# EasyEDA Pro project 2022-4T-MNT-2.eprj

# Schematic EDA-TEST2
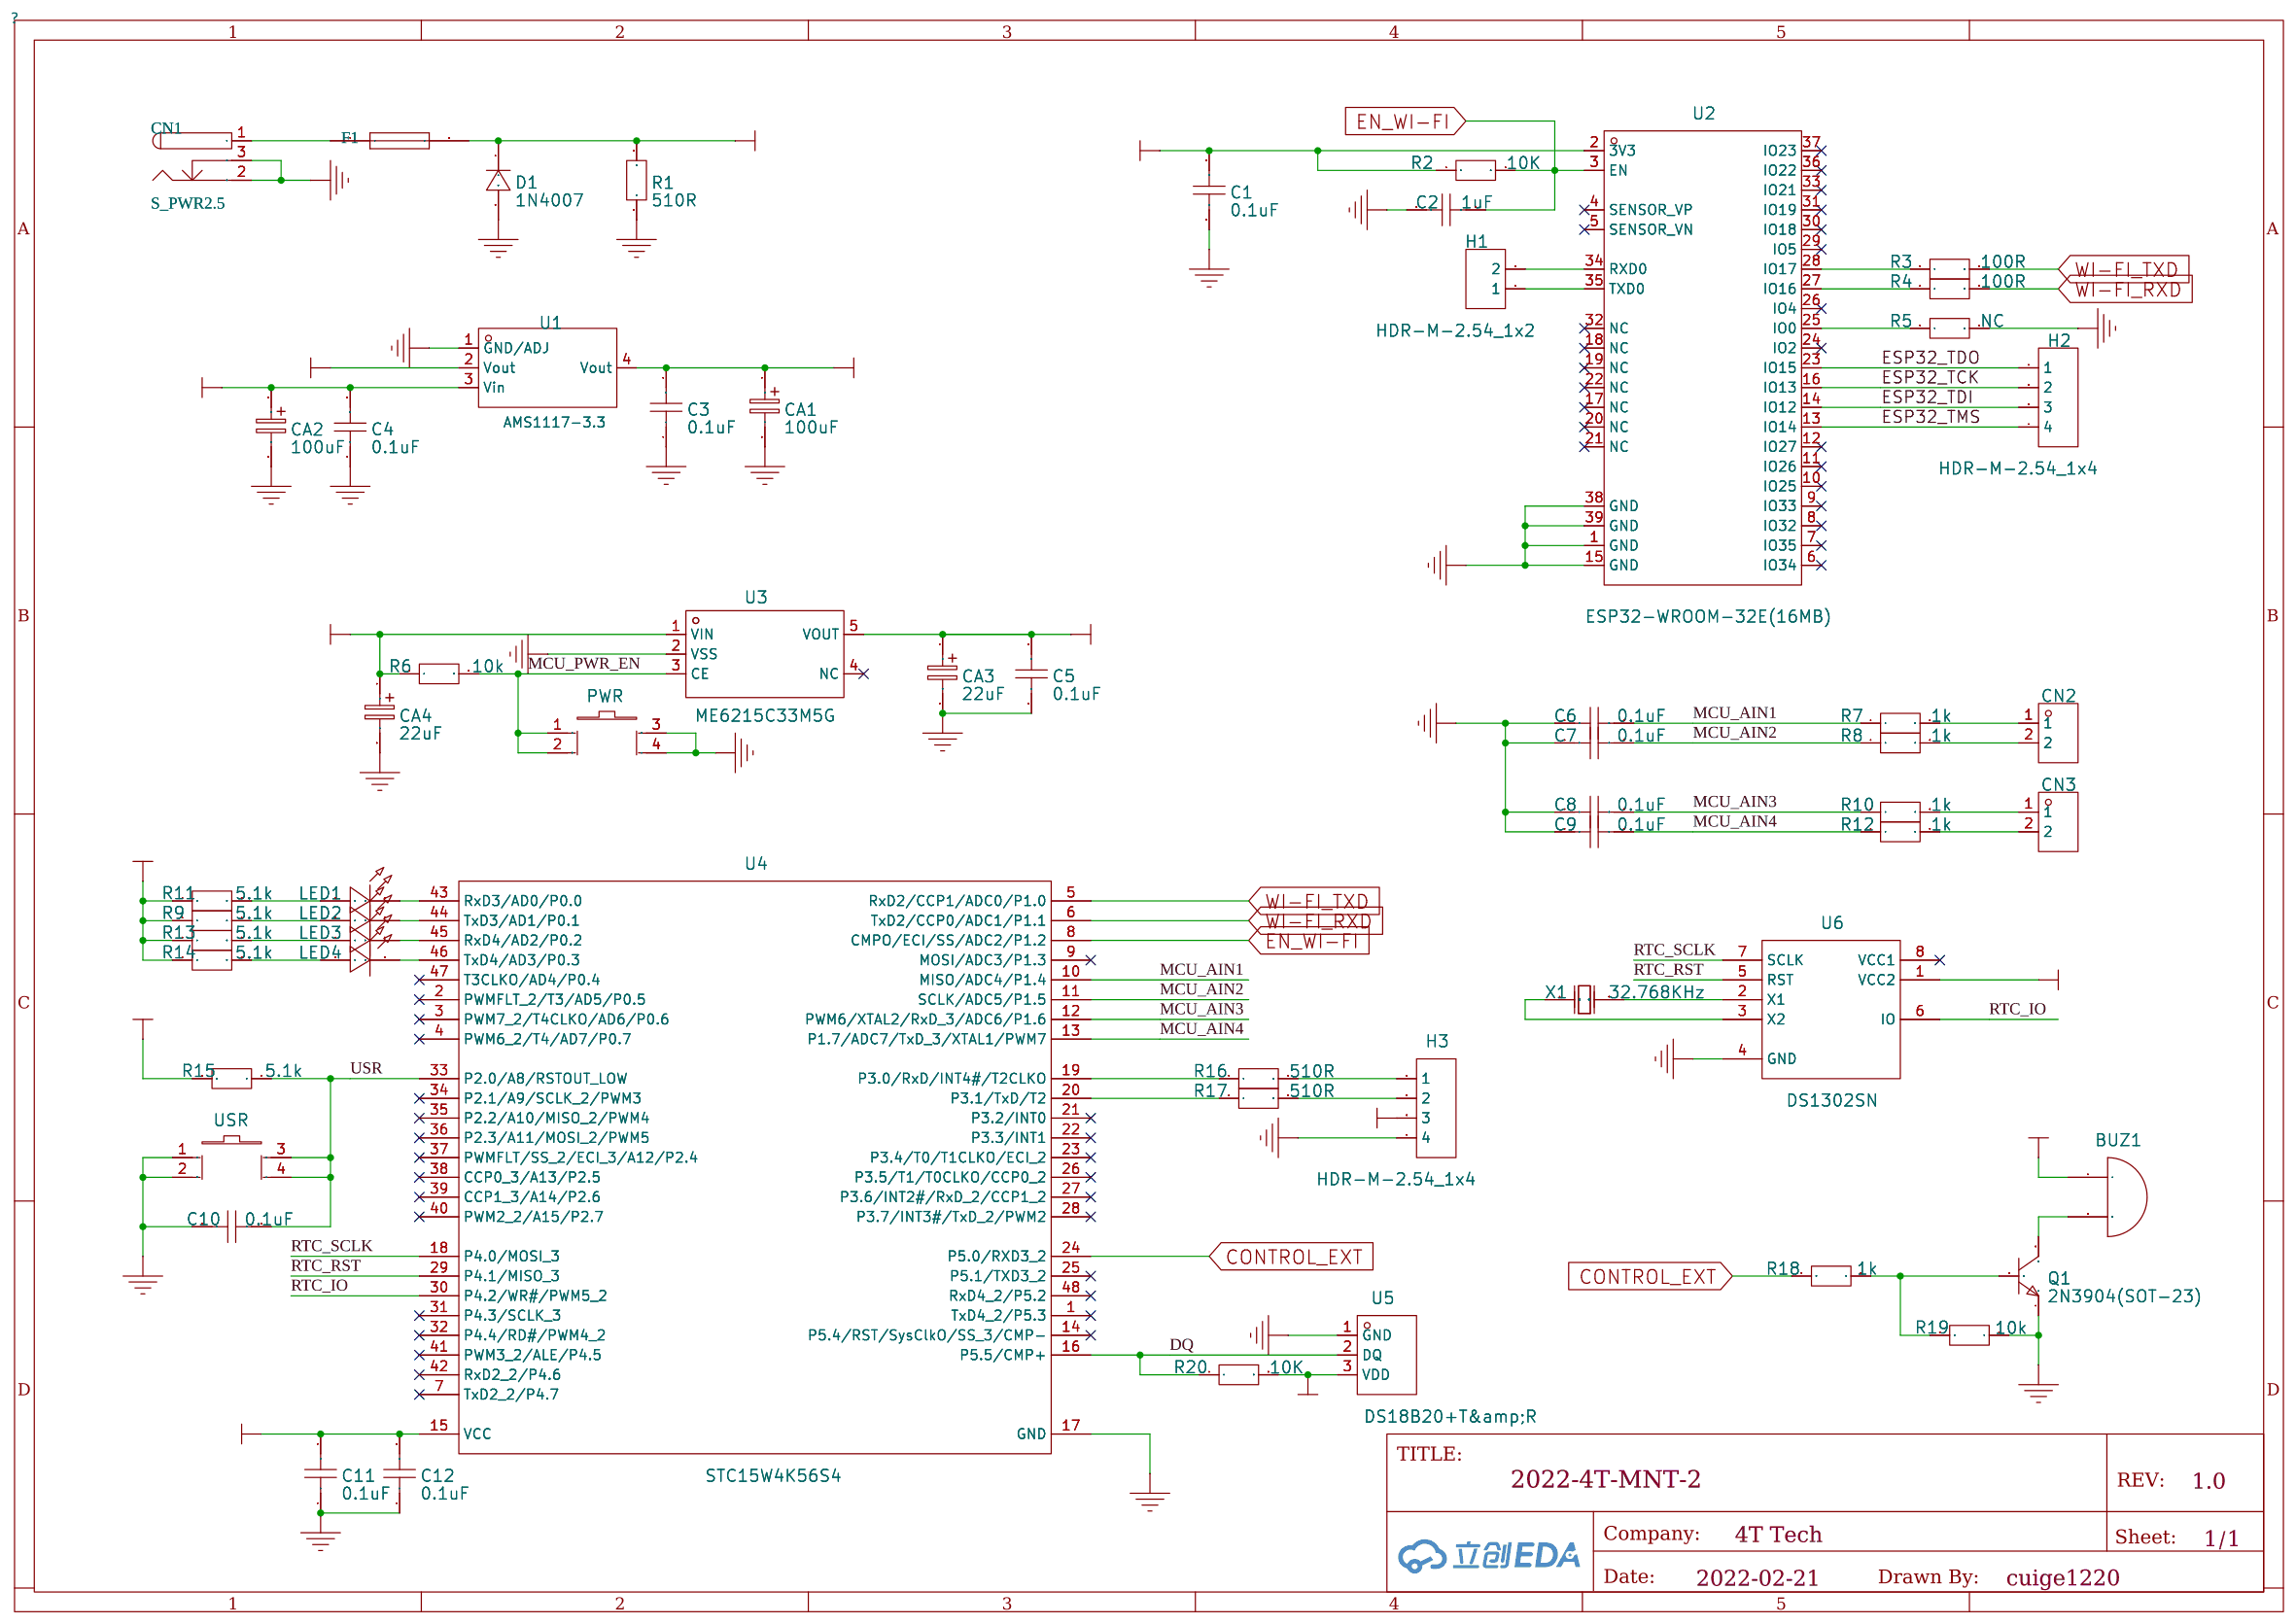
[diagram p0: schematic sheet]

## Parts
BUZ1  BUZ1  [BUZZ]
C1  0.1uF  [C0805]
C2  1uF  [C0805]
C3  0.1uF  [C0805]
C4  0.1uF  [C0805]
C5  0.1uF  [C0805]
C6  0.1uF  [C0805]
C7  0.1uF  [C0805]
C8  0.1uF  [C0805]
C9  0.1uF  [C0805]
C10  0.1uF  [C0805]
C11  0.1uF  [C0805]
C12  0.1uF  [C0805]
CA1  100uF  [C_CAP-6*H]
CA2  100uF  [C_CAP-6*H]
CA3  22uF  [C_CAP-6*H]
CA4  22uF  [C_CAP-6*H]
CN1  S_PWR2.5  [PWR2.5]
CN2  DB128L-5.08-2P  [SIP2-5.08 -A]
CN3  DB128L-5.08-2P  [SIP2-5.08 -A]
D1  1N4007  [DIODE-0.8]
F1  ASMD1210-075  [R_R1210]
H1  HDR-M-2.54_1x2  [HDR-M-2.54_1X2]
H2  HDR-M-2.54_1x4  [HDR-M-2.54_1X4]
H3  HDR-M-2.54_1x4  [HDR-M-2.54_1X4]
LED1  LED-TH-3mm_R  [D_LED-5MM]
LED2  LED-TH-3mm_R  [D_LED-5MM]
LED3  LED-TH-3mm_R  [D_LED-5MM]
LED4  LED-TH-3mm_R  [D_LED-5MM]
PWR  6x6x6Plastic head  [SW-SMD_4P]
Q1  2N3904(SOT-23)  [SOT-23-3]
R1  510R  [R0805]
R2  10K  [R0805]
R3  100R  [R0805]
R4  100R  [R0805]
R5  NC  [R0805]
R6  10k  [R0805]
R7  1k  [R0805]
R8  1k  [R0805]
R9  5.1k  [R0805]
R10  1k  [R0805]
R11  5.1k  [R0805]
R12  1k  [R0805]
R13  5.1k  [R0805]
R14  5.1k  [R0805]
R15  5.1k  [R0805]
R16  510R  [R0805]
R17  510R  [R0805]
R18  1k  [R0805]
R19  10k  [R0805]
R20  10K  [R0805]
U1  AMS1117-3.3  [SOP-SOT-223]
U2  ESP32-WROOM-32E(16MB)  [ESP32-WROOM-32E]
U3  ME6215C33M5G  [SOT-23-5]
U4  STC15W4K56S4  [QFP-LQFP-48]
U5  DS18B20+T&amp;R  [TO92C]
U6  DS1302SN  [SOP-8]
USR  6x6x6Plastic head  [SW-SMD_4P]
X1  32.768KHz  [XTAL-DT38]

## Library data of the parts
BUZ1 = BUZ1
C1 C3-C12 = 0.1uF
C2 = 1uF
CA1 CA2 = 100uF
CA3 CA4 = 22uF
CN1 = S_PWR2.5
CN2 CN3 = DB128L-5.08-2P: Supplier: LCSC; Supplier Part: C395868; Manufacturer: DIBO
D1 = 1N4007: Supplier: LCSC; Manufacturer: SEMTECH; Supplier Part: C106903
F1 = ASMD1210-075: Published: 8-Jun-2000; LatestRevisionDate: 17-Jul-2002; LatestRevisionNote: Re-released for DXP Platform.; PackageReference: PIN-W2/E2.8; Publisher: Altium Limited
H1 = HDR-M-2.54_1x2: Supplier Part: C124375; Supplier: LCSC
H2 H3 = HDR-M-2.54_1x4: Supplier Part: C124378; Supplier: LCSC
LED1-LED4 = 204-10SDRD/S530-A3-L: Manufacturer: EVERLIGHT(台湾亿光); Supplier Part: C84774; Supplier: LCSC
PWR USR = 6x6x6Plastic head: Supplier Part: C23550; Supplier: LCSC; Manufacturer: ReliaPro; image: http://image.lceda.cn/szlcsc/C23550.jpg
Q1 = 2n3904S-RTK/PS: Supplier: LCSC; Manufacturer: KEC; Supplier Part: C18536; Paste Type: SOT-23
R1 R16 R17 = 510R
R2 R20 = 10K
R3 R4 = 100R
R5 = NC
R6 R19 = 10k
R7 R8 R10 R12 R18 = 1k
R9 R11 R13-R15 = 5.1k
U1 = AMS1117-3.3: Supplier: LCSC; Manufacturer: AMS; image: //image.lceda.cn/szlcsc/C6186.jpg; Supplier Part: C6186; JLCPCB Part Class: Basic; JLCPCB SMD: Yes
U2 = ESP32-WROOM-32E(16MB): Supplier: LCSC; Supplier Part: C701343; Manufacturer: Espressif Systems; JLCPCB Part Class: Extended Part
U3 = ME6215C33M5G: Supplier: LCSC; Manufacturer: MICRONE; Supplier Part: C84119; JLCPCB Part Class: Extend
U4 = STC15W4K56S4: Supplier: LCSC; Manufacturer: STC; image: //image.lceda.cn/szlcsc/C81639.jpg; Supplier Part: C81639; JLCPCB Part Class: Extend
U5 = DS18B20+T&R: Supplier: LCSC; Supplier Part: C880672; Manufacturer: MAXIM(美信); JLCPCB Part Class: Extended Part
U6 = DS1302SN: Trickle Charge Timekeeping Chip
X1 = CFS-20632768EZFB: Supplier: LCSC; Supplier Part: C326534; Manufacturer: CITIZEN

## Nets
3.3V_MCU: BUZ1.1(A) C5.2 C11.2 C12.2 CA3.1 H3.3 R9.1 R11.1 R13.1 R14.1 R15.2 R20.2 U3.5(VOUT) U4.15(VCC) U5.3(VDD) U6.1(VCC2)
3.3V_WIFI: C1.2 C3.2 CA1.1 R2.1 U1.2(Vout) U1.4(Vout) U2.2(3V3)
+5V0: C4.2 CA2.1 CA4.1 D1.1 F1.2 R1.2 R6.1 U1.3(Vin) U3.1(VIN)
GND: C1.1 C2.2 C3.1 C4.1 C5.1 C6.1 C7.1 C8.1 C9.1 C10.2 C11.1 C12.1 CA1.2 CA2.2 CA3.2 CA4.2 CN1.2 CN1.3 D1.2 H3.4 PWR.3 PWR.4 Q1.1(E) R1.1 R5.2 R19.1 U1.1(GND/ADJ) U2.1(GND) U2.15(GND) U2.38(GND) U2.39(GND) U3.2(VSS) U4.17(GND) U5.1(GND) U6.4(GND) USR.1 USR.2
CONTROL_EXT: R18.2 U4.24(P5.0/RXD3_2)
DQ: R20.1 U4.16(P5.5/CMP+) U5.2(DQ)
EN_WI-FI: C2.1 R2.2 U2.3(EN) U4.8(CMPO/ECI/SS/ADC2/P1.2)
ESP32_TCK: H2.2 U2.16(IO13)
ESP32_TDI: H2.3 U2.14(IO12)
ESP32_TDO: H2.1 U2.23(IO15)
ESP32_TMS: H2.4 U2.13(IO14)
MCU_AIN1: C6.2 R7.1 U4.10(MISO/ADC4/P1.4)
MCU_AIN2: C7.2 R8.1 U4.11(SCLK/ADC5/P1.5)
MCU_AIN3: C8.2 R10.1 U4.12(PWM6/XTAL2/RxD_3/ADC6/P1.6)
MCU_AIN4: C9.2 R12.1 U4.13(P1.7/ADC7/TxD_3/XTAL1/PWM7)
MCU_PWR_EN: PWR.1 PWR.2 R6.2 U3.3(CE)
RTC_IO: U4.30(P4.2/WR#/PWM5_2) U6.6(IO)
RTC_RST: U4.29(P4.1/MISO_3) U6.5(RST)
RTC_SCLK: U4.18(P4.0/MOSI_3) U6.7(SCLK)
USR: C10.1 R15.1 U4.33(P2.0/A8/RSTOUT_LOW) USR.3 USR.4
WI-FI_RXD: R4.2 U4.6(TxD2/CCP0/ADC1/P1.1)
WI-FI_TXD: R3.2 U4.5(RxD2/CCP1/ADC0/P1.0)
$1N157: R4.1 U2.27(IO16)
$1N158: R3.1 U2.28(IO17)
$1N183: H1.2 U2.34(RXD0)
$1N184: H1.1 U2.35(TXD0)
$1N223: R5.1 U2.25(IO0)
$1N393: CN2.1 R7.2
$1N403: CN2.2 R8.2
$1N404: CN3.1 R10.2
$1N405: CN3.2 R12.2
$1N495: CN1.1 F1.1
$1N538: R16.1 U4.19(P3.0/RxD/INT4#/T2CLKO)
$1N539: H3.1 R16.2
$1N549: R17.1 U4.20(P3.1/TxD/T2)
$1N550: H3.2 R17.2
$1N579: LED1.1 R9.2
$1N580: LED1.2 U4.43(RxD3/AD0/P0.0)
$1N581: LED2.1 R11.2
$1N601: LED3.1 R13.2
$1N621: LED4.1 R14.2
$1N641: LED3.2 U4.45(RxD4/AD2/P0.2)
$1N642: LED4.2 U4.46(TxD4/AD3/P0.3)
$1N643: LED2.2 U4.44(TxD3/AD1/P0.1)
$1N748: Q1.2(B) R18.1 R19.2
$1N768: BUZ1.2(B) Q1.3(C)
$1N806: U6.2(X1) X1.2(OSC2)
$1N807: U6.3(X2) X1.1(OSC1)

Not connected (* = marked no-connect by the designer): U2 4(SENSOR_VP)* 5(SENSOR_VN)* 6(IO34)* 7(IO35)* 8(IO32)* 9(IO33)* 10(IO25)* 11(IO26)* 12(IO27)* 17(NC)* 18(NC)* 19(NC)* 20(NC)* 21(NC)* 22(NC)* 24(IO2)* 26(IO4)* 29(IO5)* 30(IO18)* 31(IO19)* 32(NC)* 33(IO21)* 36(IO22)* 37(IO23)*; U3 4(NC)*; U4 1(TxD4_2/P5.3)* 2(PWMFLT_2/T3/AD5/P0.5)* 3(PWM7_2/T4CLKO/AD6/P0.6)* 4(PWM6_2/T4/AD7/P0.7)* 7(TxD2_2/P4.7)* 9(MOSI/ADC3/P1.3)* 14(P5.4/RST/SysClkO/SS_3/CMP-)* 21(P3.2/INT0)* 22(P3.3/INT1)* 23(P3.4/T0/T1CLKO/ECI_2)* 25(P5.1/TXD3_2)* 26(P3.5/T1/T0CLKO/CCP0_2)* 27(P3.6/INT2#/RxD_2/CCP1_2)* 28(P3.7/INT3#/TxD_2/PWM2)* 31(P4.3/SCLK_3)* 32(P4.4/RD#/PWM4_2)* 34(P2.1/A9/SCLK_2/PWM3)* 35(P2.2/A10/MISO_2/PWM4)* 36(P2.3/A11/MOSI_2/PWM5)* 37(PWMFLT/SS_2/ECI_3/A12/P2.4)* 38(CCP0_3/A13/P2.5)* 39(CCP1_3/A14/P2.6)* 40(PWM2_2/A15/P2.7)* 41(PWM3_2/ALE/P4.5)* 42(RxD2_2/P4.6)* 47(T3CLKO/AD4/P0.4)* 48(RxD4_2/P5.2)*; U6 8(VCC1)*

# Board PCB1
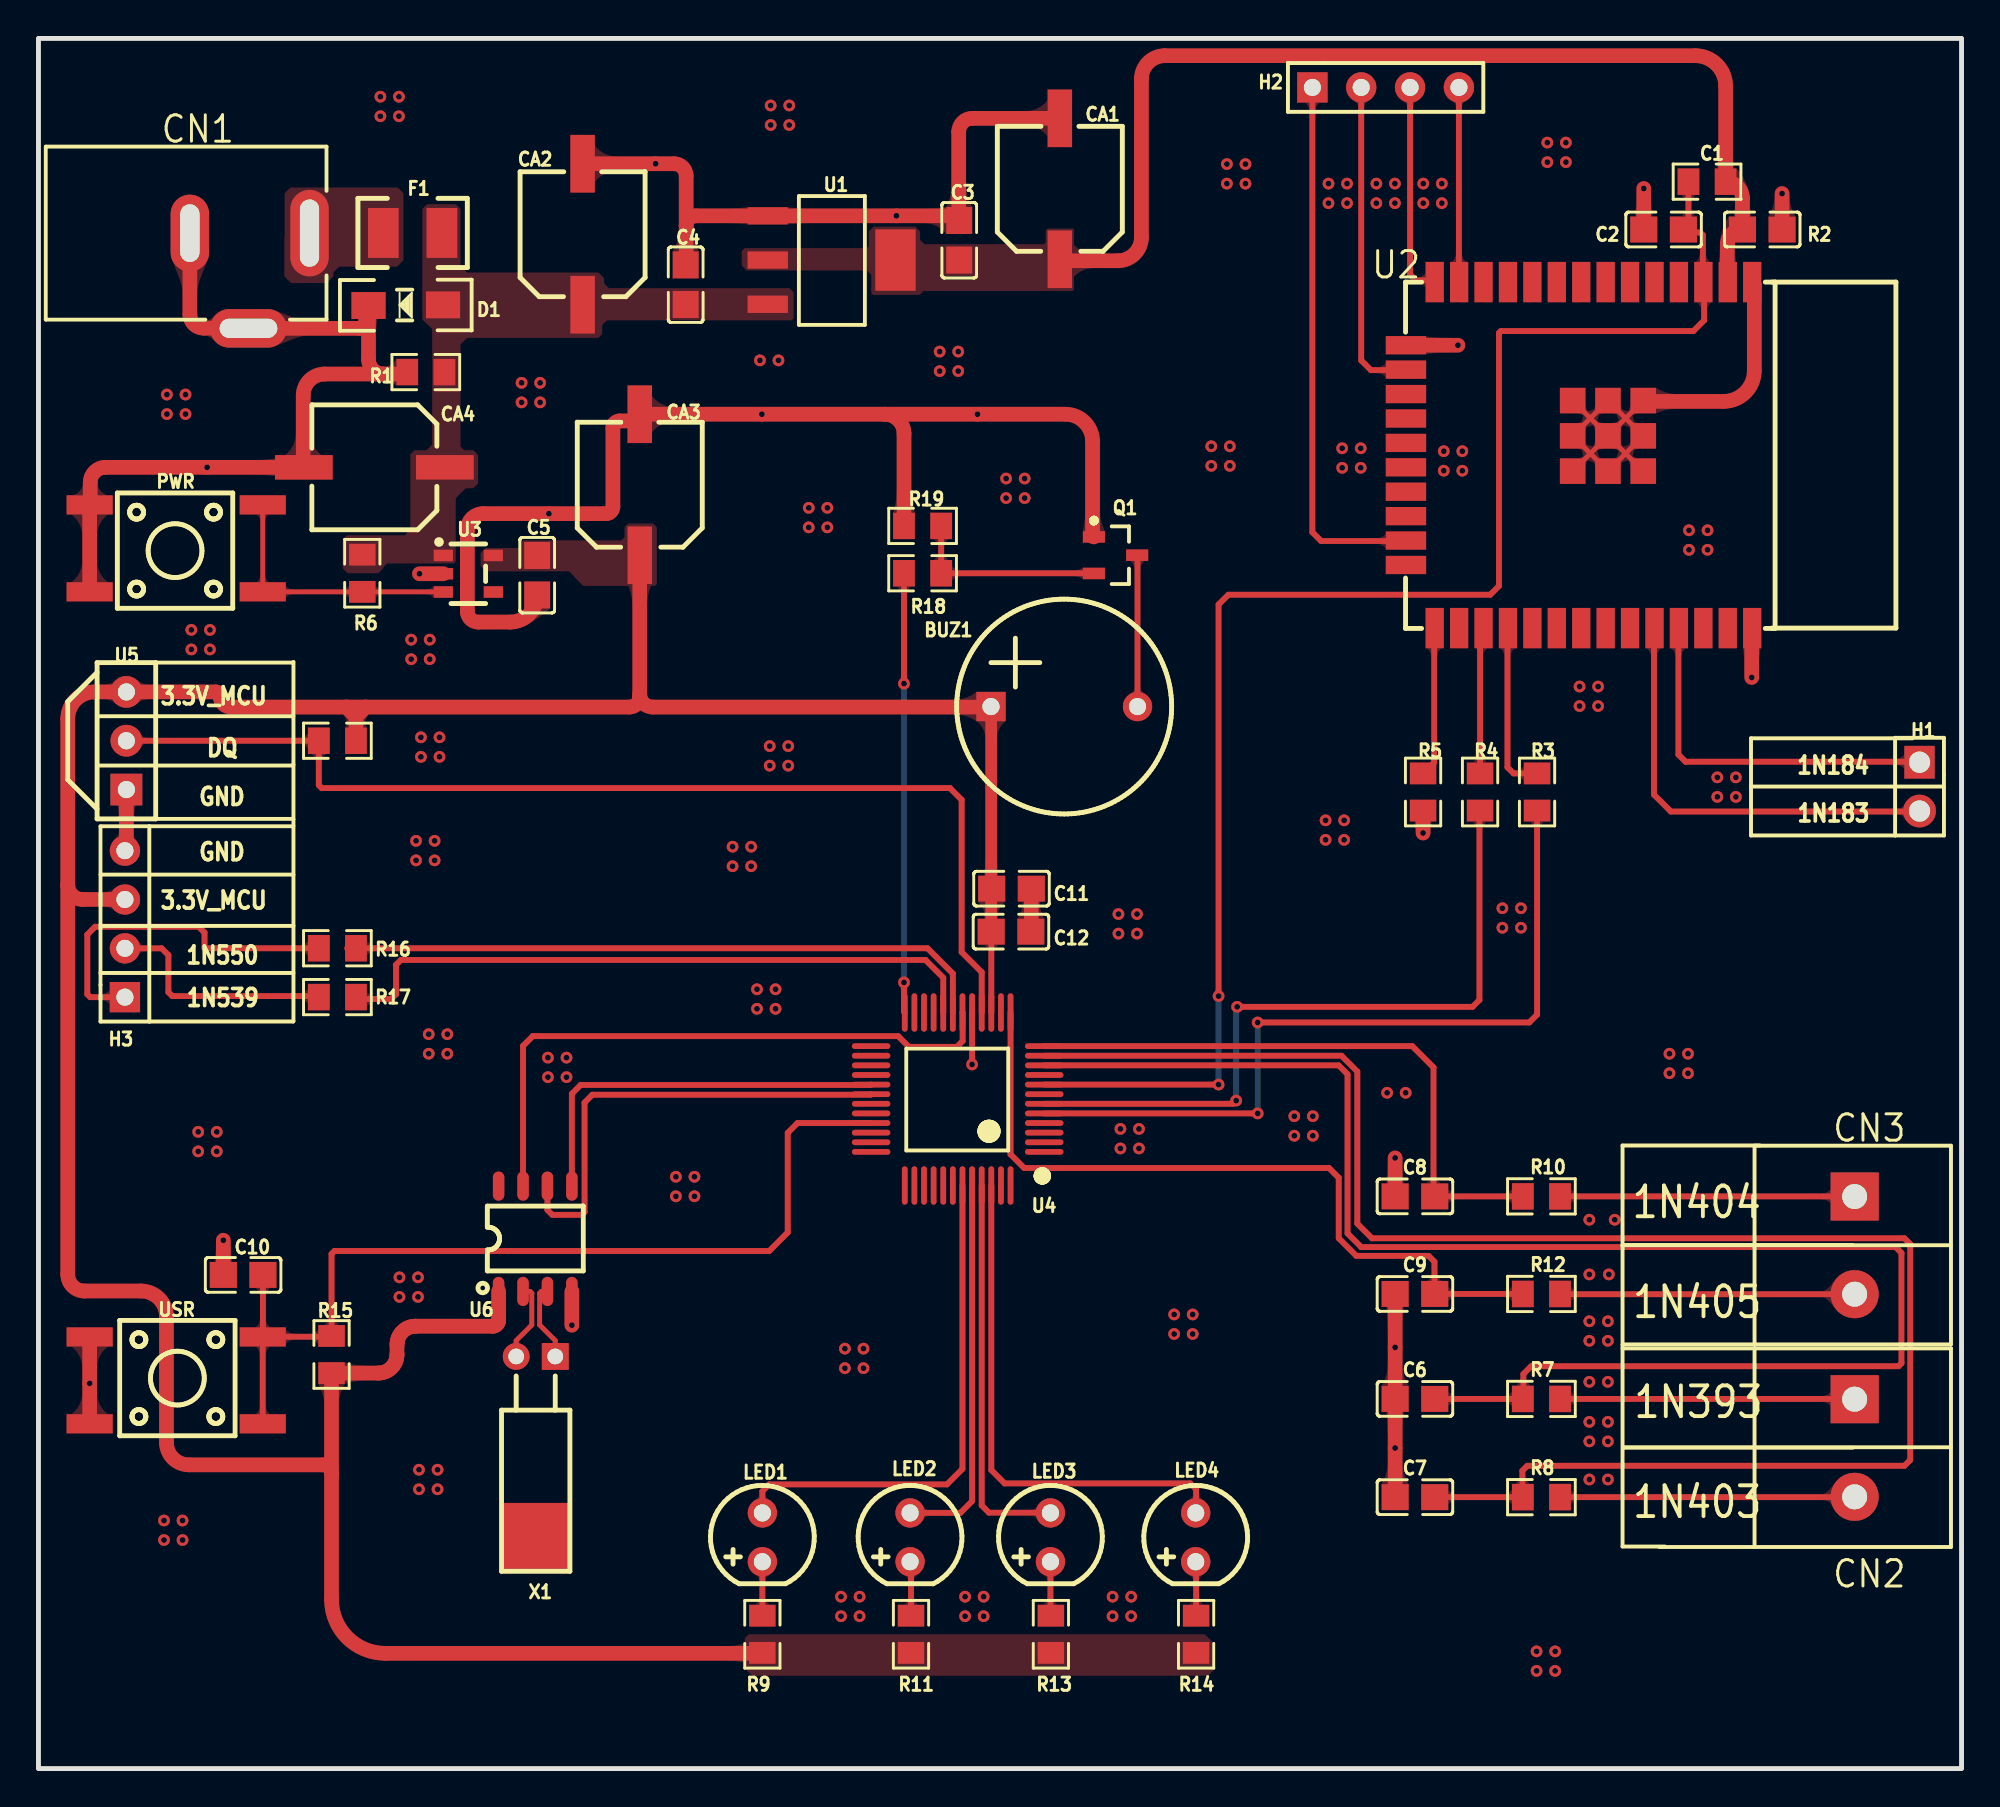
[diagram p1: board, top side]
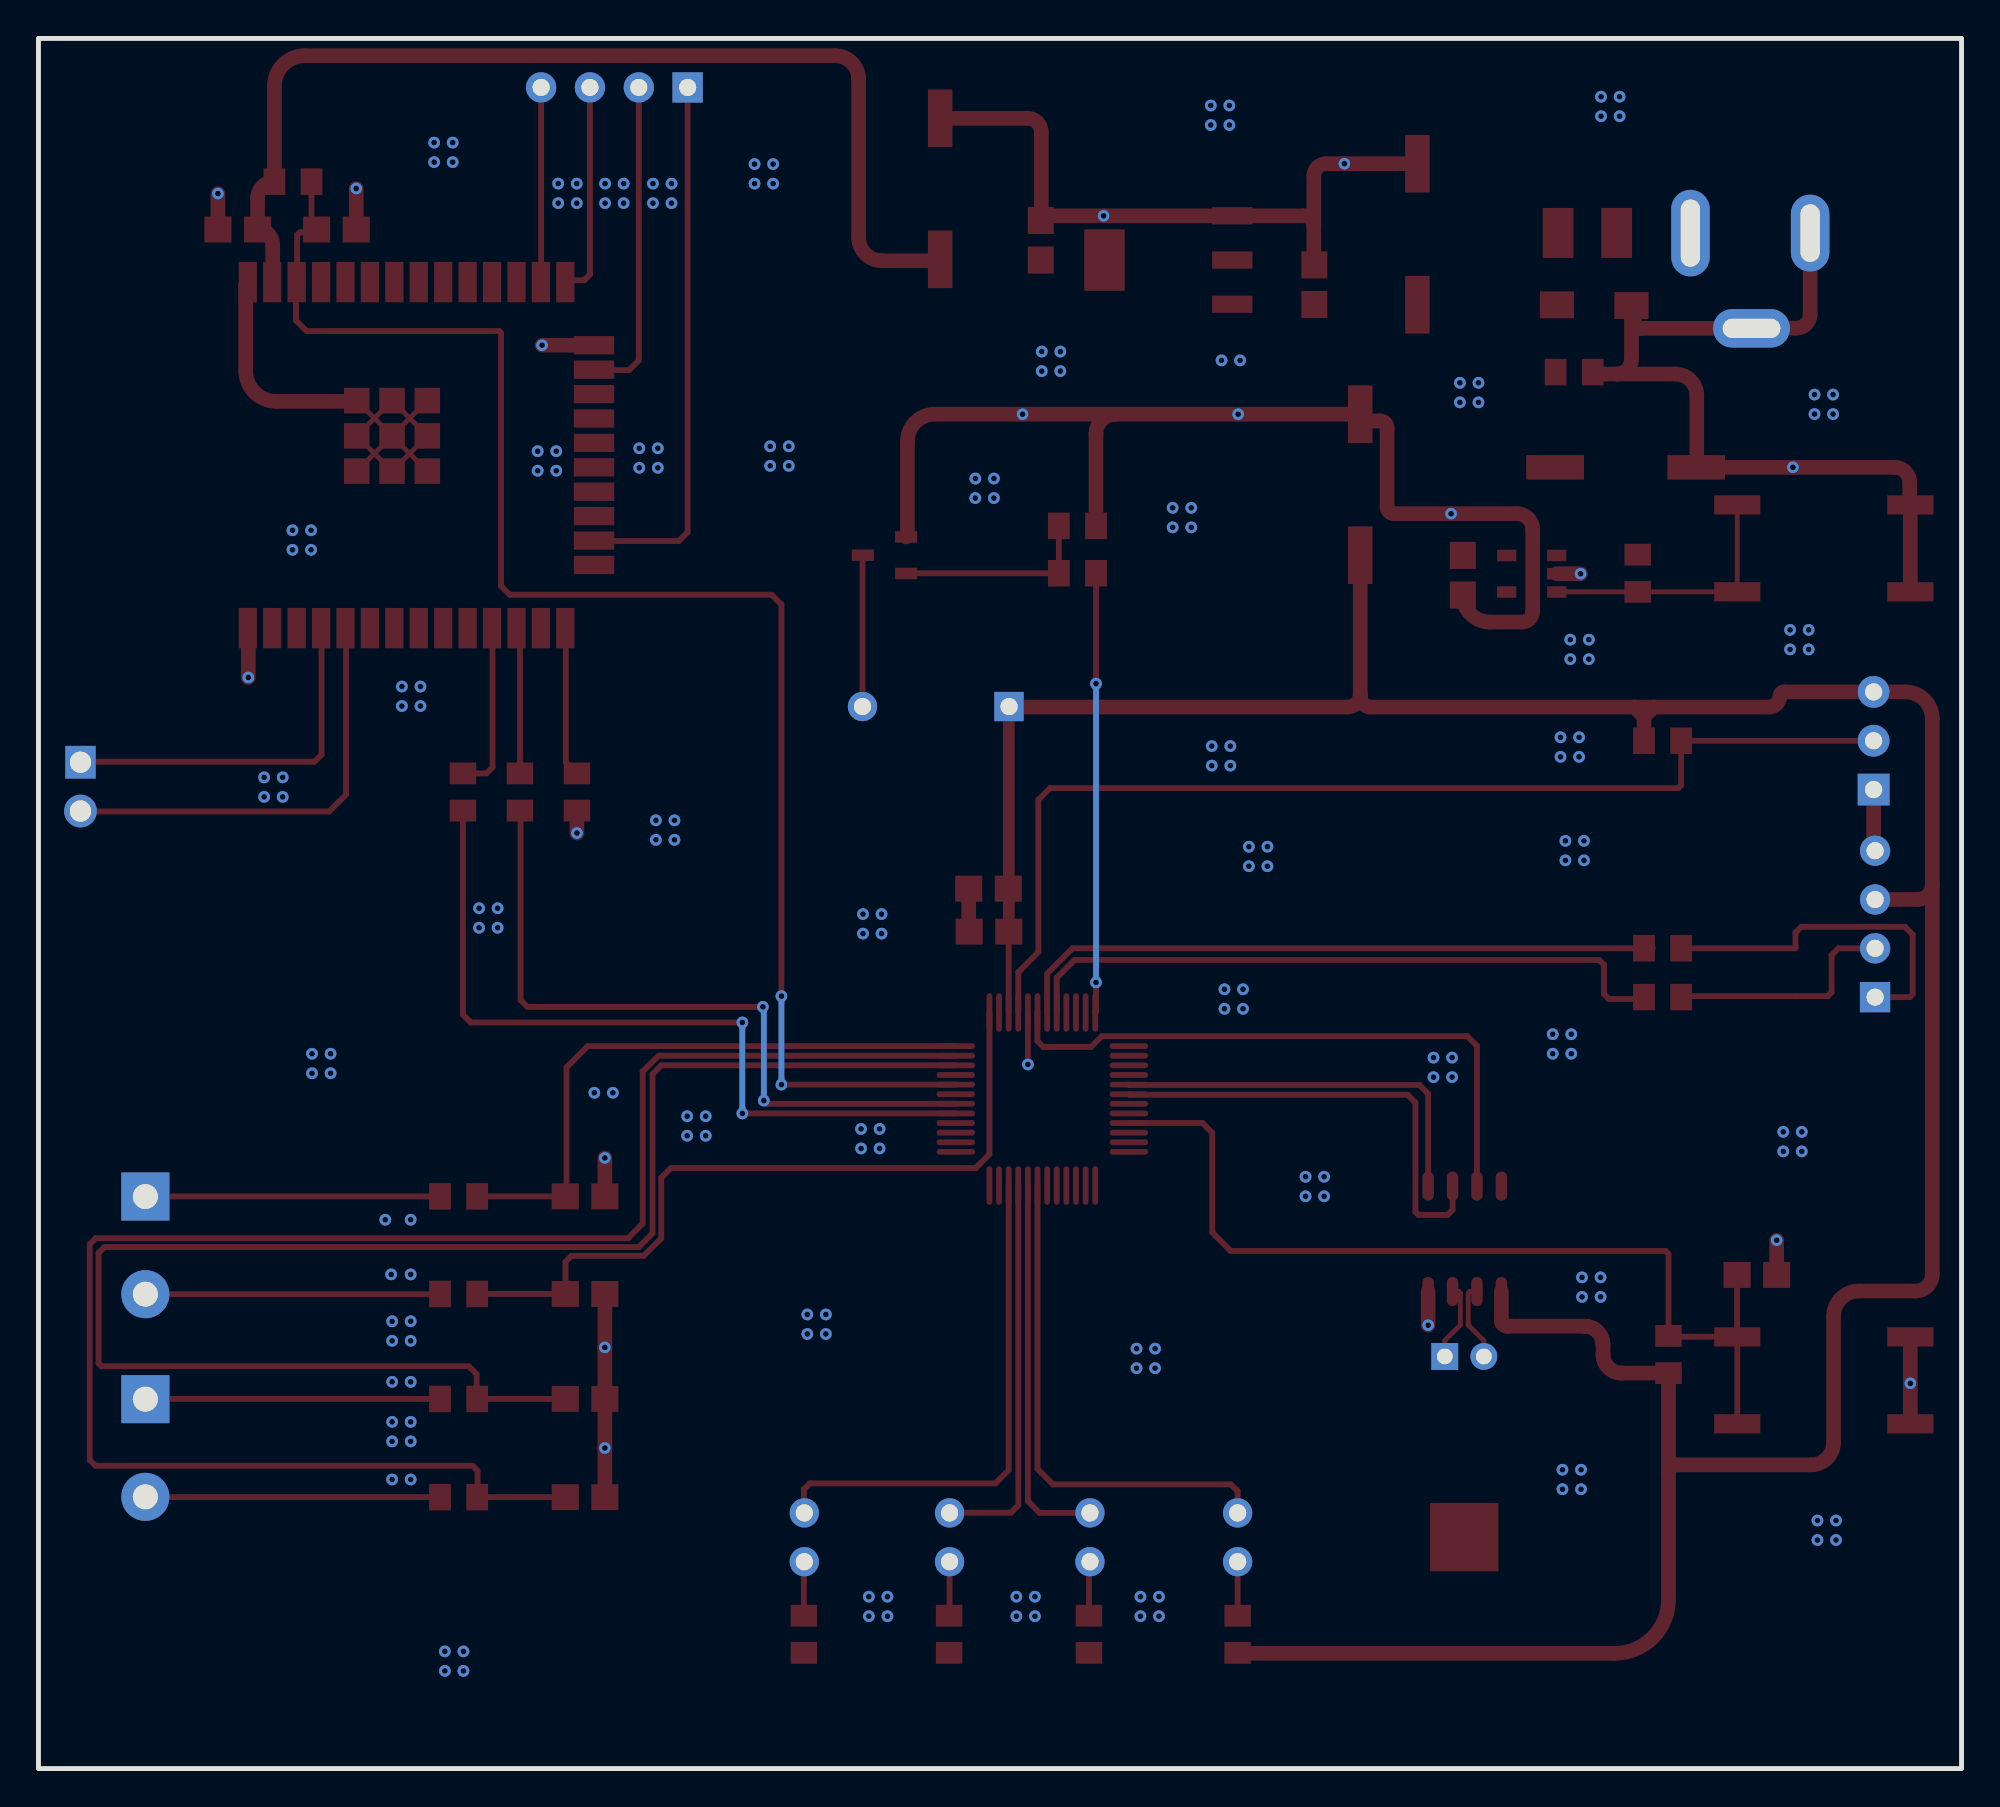
[diagram p2: board, bottom side, seen from below]

Outline 100 x 90 mm; copper layers: Top Layer, Bottom Layer. Coordinates in mm from the lower left corner of the outline.
Outline path: rectangle 0,90 100,0
Stack: Top Layer 0.035mm / Dielectric1 1.51mm FR4 er 4.5 / Bottom Layer 0.035mm

## Design rules (mm)
net $1N806: DP1
net $1N807: DP1
template: 自定义配置
spacing copperThickness1oz (default): track to track 0.152, other pairs 0.076 to 0.3
spacing copperThickness2oz: track to track 0.203, other pairs 0.152 to 0.3
track width copperThickness1oz (default): min 0.254, default 0.305, max 2.54
track width copperThickness2oz: min 0.203, default 0.254, max 2.54
track width PWR: min 0.254, default 0.762, max 2.54
differential pair differentialPair (default): width min 0.127, default 0.254, max 2.54; gap min 0.152, default 0.152
via viaSize (default): diameter min 0.203, default 0.61, max 10.16; hole min 0.203, default 0.305, max 6.299
net 3.3V_WIFI uses PWR
net GND uses PWR
net +5V0 uses PWR
net 3.3V_MCU uses PWR

## Placement (name value [footprint] x y rotation side)
BUZ1  BUZ1  [BUZZ]  49.53 55.24 0 top
C1  0.1uF  [C0805]  89.64 80.06 180 top
C2  1uF  [C0805]  84.51 80.06 180 top
C3  0.1uF  [C0805]  47.88 79.5 270 top
C4  0.1uF  [C0805]  33.66 77.19 270 top
C5  0.1uF  [C0805]  25.93 62.08 90 top
C6  0.1uF  [C0805]  71.58 19.23 0 top
C7  0.1uF  [C0805]  71.58 14.12 0 top
C8  0.1uF  [C0805]  71.58 29.76 0 top
C9  0.1uF  [C0805]  71.58 24.69 0 top
C10  0.1uF  [C0805]  10.64 25.68 180 top
C11  0.1uF  [C0805]  50.6 45.77 180 top
C12  0.1uF  [C0805]  50.57 43.54 180 top
CA1  100uF  [C_CAP-6*H]  53.11 78.51 90 top
CA2  100uF  [C_CAP-6*H]  28.3 76.15 90 top
CA3  22uF  [C_CAP-6*H]  31.27 63.12 90 top
CA4  22uF  [C_CAP-6*H]  21.13 67.69 180 top
CN1  S_PWR2.5  [PWR2.5]  8 80 0 top
CN2  DB128L-5.08-2P  [SIP2-5.08 -A]  94.44 19.21 270 top
CN3  DB128L-5.08-2P  [SIP2-5.08 -A]  94.44 29.76 270 top
D1  1N4007  [DIODE-0.8]  19.1 76.12 180 top
F1  ASMD1210-075  [R_R1210]  17.93 79.88 0 top
H1  HDR-M-2.54_1x2  [HDR-M-2.54_1X2]  97.82 51.08 270 top
H2  HDR-M-2.54_1x4  [HDR-M-2.54_1X4]  70.05 87.45 0 top
H3  HDR-M-2.54_1x4  [HDR-M-2.54_1X4]  4.5 43.94 90 top
LED1  LED-TH-3mm_R  [D_LED-5MM]  37.64 12.03 180 top
LED2  LED-TH-3mm_R  [D_LED-5MM]  45.32 12.03 180 top
LED3  LED-TH-3mm_R  [D_LED-5MM]  52.62 12.03 180 top
LED4  LED-TH-3mm_R  [D_LED-5MM]  60.18 12.03 180 top
PWR  6x6x6Plastic head  [SW-SMD_4P]  7.16 63.47 180 top
Q1  2N3904(SOT-23)  [SOT-23-3]  56.01 63.12 0 top
R1  510R  [R0805]  20.14 72.64 0 top
R2  10K  [R0805]  86.77 82.55 180 top
R3  100R  [R0805]  77.93 50.8 270 top
R4  100R  [R0805]  74.96 50.8 270 top
R5  NC  [R0805]  72 50.8 270 top
R6  10k  [R0805]  16.84 62.18 270 top
R7  1k  [R0805]  78.15 19.23 0 top
R8  1k  [R0805]  78.15 14.12 0 top
R9  5.1k  [R0805]  37.64 6.98 90 top
R10  1k  [R0805]  78.15 29.76 0 top
R11  5.1k  [R0805]  45.37 6.98 90 top
R12  1k  [R0805]  78.15 24.69 0 top
R13  5.1k  [R0805]  52.65 6.98 90 top
R14  5.1k  [R0805]  60.2 6.98 90 top
R15  5.1k  [R0805]  15.24 21.54 270 top
R16  510R  [R0805]  15.55 42.67 180 top
R17  510R  [R0805]  15.55 40.13 180 top
R18  1k  [R0805]  45.97 62.18 180 top
R19  10k  [R0805]  45.97 64.64 0 top
R20  10K  [R0805]  15.55 53.47 0 top
U1  AMS1117-3.3  [SOP-SOT-223]  37.92 80.77 0 top
U2  ESP32-WROOM-32E(16MB)  [ESP32-WROOM-32E]  80.11 68.33 180 top
U3  ME6215C33M5G  [SOT-23-5]  22.35 62.15 270 top
U4  STC15W4K56S4  [QFP-LQFP-48]  52.3 32.08 180 top
U5  DS18B20+T&amp;R  [TO92C]  4.57 50.93 180 top
U6  DS1302SN  [SOP-8]  25.83 27.56 0 top
USR  6x6x6Plastic head  [SW-SMD_4P]  7.16 20.19 0 top
X1  32.768KHz  [XTAL-DT38]  26.87 21.44 0 top

## Footprints (pads in the part's own frame, mm; a bottom-side part is the same pattern mirrored in y, then rotated)
BUZZ
  rect 1.524x1.524 hole 0.894x0.889: 1(0,0)
  round 1.524 hole 0.894x0.889: 2(7.62,0)
C0805
  rect 1.41x1.35 smd: 1(-1.03,0.001) 2(1.03,0.001)
C_CAP-6*H
  rect 3x1.274 smd: 1(-0.001,0.001) 2(7.333,0.001)
D_LED-5MM
  round 1.524 hole 0.889x0.894: 1(0,1.27) 2(0,-1.27)
DIODE-0.8
  rect 1.778x1.397 smd: 1(-1.937,-0.018) 2(1.938,0.018)
ESP32-WROOM-32E
  rect 0.95x2.1 smd: 1(-9.002,-9) 2(-7.732,-9) 3(-6.463,-9) 4(-5.192,-9) 5(-3.922,-9) 6(-2.652,-9) 7(-1.383,-9) 8(-0.113,-9) 9(1.157,-9) 10(2.428,-9) 11(3.697,-9) 12(4.968,-9) 13(6.237,-9) 14(7.508,-9) 25(7.508,9) 26(6.237,9) 27(4.968,9) 28(3.697,9) 29(2.428,9) 30(1.157,9) 31(-0.113,9) 32(-1.383,9) 33(-2.652,9) 34(-3.922,9) 35(-5.192,9) 36(-6.463,9) 37(-7.732,9) 38(-9.002,9)
  rect 2.1x0.95 smd: 15(9.002,-5.715) 16(9.002,-4.444) 17(9.002,-3.175) 18(9.002,-1.905) 19(9.002,-0.634) 20(9.002,0.635) 21(9.002,1.905) 22(9.002,3.175) 23(9.002,4.446) 24(9.002,5.715)
  rect 1.33x1.33 smd: 39(-1.502,-1) 40(-1.502,-2.835) 41(-1.502,0.835) 42(-3.337,0.835) 43(-3.337,-1) 44(-3.337,-2.835) 45(0.333,-2.835) 46(0.333,-1) 47(0.333,0.835)
HDR-M-2.54_1X2
  rect 1.7x1.575 hole 1.105x1.1: 1(-1.27,0)
  round 1.7 hole 1.105x1.1: 2(1.27,0)
HDR-M-2.54_1X4
  rect 1.575x1.575 hole 0.889: 1(-3.81,0)
  round 1.575 hole 0.889: 2(-1.27,0) 3(1.27,0) 4(3.81,0)
PWR2.5
  oval 2x4.5 hole 1x3.5: 1(6.096,-0.127)
  oval 2x4 hole 1x3: 2(-0.127,-0.127)
  oval 4x2 hole 3x1: 3(2.921,-5.08)
QFP-LQFP-48
  oval 2x0.3 smd: 1(0,0) 2(0,-0.5) 3(0,-1) 4(0,-1.5) 5(0,-2) 6(0,-2.5) 7(0,-3) 8(0,-3.5) 9(0,-4) 10(0,-4.5) 11(0,-5) 12(0,-5.5) 25(9,-5.5) 26(9,-5) 27(9,-4.5) 28(9,-4) 29(9,-3.5) 30(9,-3) 31(9,-2.5) 32(9,-2) 33(9,-1.5) 34(9,-1) 35(9,-0.5) 36(9,0)
  oval 0.3x2 smd: 13(1.75,-7.25) 14(2.25,-7.25) 15(2.75,-7.25) 16(3.25,-7.25) 17(3.75,-7.25) 18(4.25,-7.25) 19(4.75,-7.25) 20(5.25,-7.25) 21(5.75,-7.25) 22(6.25,-7.25) 23(6.75,-7.25) 24(7.25,-7.25) 37(7.25,1.75) 38(6.75,1.75) 39(6.25,1.75) 40(5.75,1.75) 41(5.25,1.75) 42(4.75,1.75) 43(4.25,1.75) 44(3.75,1.75) 45(3.25,1.75) 46(2.75,1.75) 47(2.25,1.75) 48(1.75,1.75)
R0805
  rect 1.133x1.377 smd: 1(-0.967,0) 2(0.967,0)
R_R1210
  rect 1.6x2.6 smd: 1(0,0) 2(3.048,0)
SIP2-5.08 -A
  rect 2.5x2.5 hole 1.3: 1(0,0)
  round 2.5 hole 1.3: 2(5.08,0)
SOP-8
  oval 0.6x1.52 smd: 1(-1.905,-2.74) 2(-0.635,-2.74) 3(0.635,-2.74) 4(1.905,-2.74) 5(1.905,2.74) 6(0.635,2.74) 7(-0.635,2.74) 8(-1.905,2.74)
SOP-SOT-223
  rect 2.1x0.9 smd: 1(-0.001,0.001) 2(-0.001,-2.3) 3(-0.001,-4.599)
  rect 2.1x3.2 smd: 4(6.644,-2.3)
SOT-23-3
  rect 1.15x0.6 smd: 1(-1.125,0.95) 2(-1.125,-0.95) 3(1.125,0)
SOT-23-5
  rect 0.6x1 smd: 1(-0.95,-1.3) 2(0,-1.3) 3(0.95,-1.3) 4(0.95,1.3) 5(-0.95,1.3)
SW-SMD_4P
  rect 2.4x1 smd: 1(-4.5,2.26) 2(-4.5,-2.26) 3(4.5,-2.26) 4(4.5,2.26)
TO92C
  rect 1.651x1.651 hole 0.889x0.894: 1(0,0)
  round 1.651 hole 0.889x0.894: 2(0,-2.54) 3(0,-5.08)
XTAL-DT38
  rect 3.556x3.556 smd: 0(-1.016,-9.398)
  rect 1.397x1.397 hole 0.818x0.813: 1(0,0)
  round 1.397 hole 0.818x0.813: 2(-2.032,0)

## Nets
As in the schematic, except:
GND: C1.1 C2.2 C3.1 C4.1 C5.1 C6.1 C7.1 C8.1 C9.1 C10.2 C11.1 C12.1 CA1.2 CA2.2 CA3.2 CA4.2 CN1.2 CN1.3 D1.2 H3.4 PWR.3 PWR.4 Q1.1 R1.1 R5.2 R19.1 U1.1 U2.1 U2.15 U2.38 U2.39 U2.40 U2.41 U2.42 U2.43 U2.44 U2.45 U2.46 U2.47 U3.2 U4.17 U5.1 U6.4 USR.1 USR.2

Pads without a net: U2 4 5 6 7 8 9 10 11 12 17 18 19 20 21 22 24 26 29 30 31 32 33 36 37; U3 4; U4 1 2 3 4 7 9 14 21 22 23 25 26 27 28 31 32 34 35 36 37 38 39 40 41 42 47 48; U6 8; X1 0

## Via types
v1: diameter 0.61, hole 0.305, Top Layer to Bottom Layer, 223 vias

## Routing (per net, layer and track width the routed paths; a pad name or vN(x,y) marks a point on that pad's centre or on a via; arc(x,y) is an arc through that point)
3.3V_MCU: length 182.1
  Top Layer w0.305: U4.15 49.55,43.53 arc(49.55,43.53) 49.54,43.54
  Top Layer w0.61: 49.54,45.74 49.54,55.23 arc(49.54,55.24) BUZ1.1 ; 49.54,45.74 49.54,43.54 ; 49.54,45.74 arc(49.55,45.76) C11.2
  Top Layer w0.762: 15.24,15.35 15.24,8.79 arc(16.06,6.81) 18.03,5.99 37.62,5.99 arc(37.64,6) R9.1 ; 15.24,15.35 15.24,20.57 17.68,20.57 ; 15.24,15.35 arc(15.11,15.67) 14.79,15.8 7.82,15.8 arc(7,16.14) 6.66,16.97 6.66,23.52 arc(6.27,24.45) 5.33,24.84 2.39,24.84 arc(1.78,25.09) 1.52,25.7 1.52,45.97 ; 23.93,24.82 23.93,23.32 ; 23.93,23.32 arc(23.84,23.1) 23.62,23.01 ; 23.93,23.32 arc(23.84,23.1) 23.62,23.01 ; 31.27,55.88 CA3.1 ; 31.27,55.88 31.27,55.75 ; 31.27,55.88 arc(31.46,55.41) 31.93,55.22 49.5,55.22 arc(49.52,55.23) BUZ1.1 ; 16.01,55.22 10.01,55.22 arc(9.61,55.38) 9.45,55.78 arc(9.38,55.94) 9.22,56.01 U5.3 2.92,56.01 arc(1.93,55.6) 1.52,54.61 1.52,45.97 ; 16.01,55.22 16.51,54.72 ; 16.01,55.22 17.01,55.22 ; 18.64,22.05 18.64,21.54 ; 18.64,22.05 arc(18.93,22.73) 19.61,23.01 ; 18.64,22.05 arc(18.93,22.73) 19.61,23.01 ; 18.64,21.54 arc(18.36,20.86) 17.68,20.57 ; 18.64,21.54 arc(18.36,20.86) 17.68,20.57 ; 31.27,55.75 31.27,55.61 ; 31.27,55.75 arc(31.11,55.38) 30.73,55.22 17.01,55.22 ; 1.52,45.97 arc(1.75,45.44) 2.29,45.21 4.49,45.21 arc(4.49,45.21) H3.3 ; 17.01,55.22 16.51,54.72 16.51,54.72 ; 16.51,54.72 R20.2 ; 23.62,23.01 19.61,23.01
3.3V_WIFI: length 56.4
  Top Layer w0.762: 87.82,77.3 87.82,79.27 arc(88.05,79.83) C1.2 88.61,81.68 arc(88.35,82.29) R2.1 87.73,87.53 arc(87.27,88.64) 86.16,89.1 58.57,89.1 arc(57.71,88.75) 57.35,87.88 57.35,79.65 arc(57,78.79) 56.13,78.43 53.19,78.43 arc(53.13,78.46) CA1.1
GND: length 212.8
  Top Layer w0.254: U2.44 82.53,70.24 ; 82.53,70.24 U2.43 82.53,68.41 ; 82.53,70.24 U2.40 80.7,70.24 ; 82.53,70.24 U2.39 ; 82.53,68.41 83.45,67.49 ; 82.53,68.41 81.61,67.49 80.7,68.41 ; 82.53,68.41 U2.39 ; 80.7,70.24 U2.46 80.7,68.41 ; 80.7,70.24 U2.45 ; 80.7,70.24 U2.39 ; 80.7,68.41 U2.47 ; 80.7,68.41 U2.39
  Top Layer w0.305: U4.17 v1(48.55,36.63)
  Top Layer w0.762: 17.93,72.54 19.07,72.54 arc(19.15,72.57) R1.1 ; 17.93,72.54 14.88,72.54 arc(14.09,72.22) 13.77,71.42 13.77,67.72 arc(13.78,67.7) CA4.2 v1(8.77,67.69) 3.48,67.69 arc(2.92,67.46) 2.69,66.9 2.69,65.76 arc(2.68,65.74) PWR.3 PWR.4 ; 17.93,72.54 arc(17.39,72.77) 17.16,73.31 D1.2 arc(17.06,76.06) 17.02,75.96 17.02,75.23 arc(16.93,75.01) 16.7,74.92 CN1.3 arc(10.92,74.93) 10.91,74.93 8.58,74.93 arc(8.08,75.14) 7.87,75.64 CN1.2 ; 28.29,83.48 v1(32.09,83.48) 33.05,83.48 arc(33.5,83.3) 33.68,82.85 33.68,80.26 ; C9.1 v1(70.55,21.91) C6.1 v1(70.55,16.67) C7.1 ; 33.68,80.26 33.68,78.25 arc(33.67,78.23) C4.1 ; 33.68,80.26 arc(33.83,80.62) 34.2,80.77 U1.1 v1(44.61,80.77) 47.64,80.77 arc(47.77,80.74) 47.85,80.64 ; 9.61,25.68 v1(9.61,27.48) ; C11.1 51.63,43.56 arc(51.62,43.54) 51.6,43.54 ; CA1.2 48.56,85.84 arc(48.06,85.64) 47.85,85.14 47.85,80.64 ; U6.4 v1(27.74,23.06) ; U5.1 4.57,47.82 arc(4.55,47.77) H3.4 ; C2.2 v1(83.48,82.19) ; U2.15 v1(73.81,74.04) ; 89.09,59.3 v1(89.09,56.76) ; USR.2 v1(2.66,20.04) USR.1 ; U3.2 v1(19.81,62.15) ; 47.85,80.64 47.85,80.56 arc(47.86,80.54) C3.1 ; v1(90.67,81.93) C1.1 ; C8.1 v1(70.55,31.76) ; 44,70.45 v1(37.62,70.45) CA3.2 arc(31.16,70.21) 30.92,70.1 30.23,70.1 arc(29.97,70) 29.87,69.75 29.87,65.63 arc(29.77,65.38) 29.51,65.28 v1(26.54,65.28) 23.11,65.28 arc(22.54,65.04) 22.3,64.46 22.3,60.2 arc(22.46,59.8) 22.86,59.64 24.53,59.64 arc(25.52,60.05) C5.1 ; 44,70.45 v1(48.83,70.45) 53.4,70.45 arc(54.4,70.04) 54.81,69.04 54.81,64.14 arc(54.83,64.09) Q1.1 ; 44,70.45 arc(44.71,70.16) 45.01,69.44 45.01,64.64 ; R5.2 v1(72,48.67) ; U2.44 arc(83.46,71.13) 83.49,71.12 87.63,71.12 arc(88.76,71.59) 89.22,72.71 89.22,77.16 arc(89.13,77.2) 89.09,77.3
  vias: v1(6.53,12.9) v1(6.53,11.89) v1(6.68,71.48) v1(6.68,70.46) v1(7.49,12.9) v1(7.49,11.89) v1(7.65,71.48) v1(7.65,70.46) v1(7.95,59.23) v1(7.95,58.22) v1(8.31,33.12) v1(8.31,32.11) v1(8.92,59.23) v1(8.92,58.22) v1(9.27,33.12) v1(9.27,32.11) v1(17.78,86.97) v1(17.78,85.95) v1(18.75,86.97) v1(18.75,85.95) v1(18.77,25.55) v1(18.77,24.54) v1(19.38,58.72) v1(19.38,57.71) v1(19.63,48.26) v1(19.63,47.24) v1(19.74,25.55) v1(19.74,24.54) v1(19.79,15.54) v1(19.79,14.53) v1(19.89,53.64) v1(19.89,52.63) v1(20.35,58.72) v1(20.35,57.71) v1(20.29,38.2) v1(20.29,37.19) v1(20.6,48.26) v1(20.6,47.24) v1(20.75,15.54) v1(20.75,14.53) v1(20.85,53.64) v1(20.85,52.63) v1(21.26,38.2) v1(21.26,37.19) v1(25.12,72.08) v1(25.12,71.07) v1(26.09,72.08) v1(26.09,71.07) v1(26.49,36.98) v1(26.49,35.97) v1(27.46,36.98) v1(27.46,35.97) v1(33.15,30.78) v1(33.15,29.77) v1(34.11,30.78) v1(34.11,29.77) v1(36.09,47.95) v1(36.09,46.94) v1(37.06,47.95) v1(37.06,46.94) v1(37.36,40.54) v1(37.36,39.52) v1(37.52,73.25) v1(38.02,53.19) v1(38.02,52.17) v1(38.07,86.51) v1(38.07,85.5) v1(38.33,40.54) v1(38.33,39.52) v1(38.48,73.25) v1(39.04,86.51) v1(39.04,85.5) v1(38.99,53.19) v1(38.99,52.17) v1(40.06,65.58) v1(40.06,64.57) v1(41.02,65.58) v1(41.02,64.57) v1(41.73,8.94) v1(41.73,7.92) v1(41.94,21.84) v1(41.94,20.83) v1(42.7,8.94) v1(42.7,7.92) v1(42.9,21.84) v1(42.9,20.83) v1(46.86,73.71) v1(46.86,72.69) v1(47.83,73.71) v1(47.83,72.69) v1(48.18,8.94) v1(48.18,7.92) v1(49.15,8.94) v1(49.15,7.92) v1(50.32,67.11) v1(50.32,66.09) v1(51.28,67.11) v1(51.28,66.09) v1(55.85,8.94) v1(55.85,7.92) v1(56.16,44.45) v1(56.16,43.43) v1(56.26,33.27) v1(56.26,32.26) v1(56.82,8.94) v1(56.82,7.92) v1(57.12,44.45) v1(57.12,43.43) v1(57.23,33.27) v1(57.23,32.26) v1(59.06,23.62) v1(59.06,22.61) v1(60.02,23.62) v1(60.02,22.61) v1(60.99,68.78) v1(60.99,67.77) v1(61.8,83.46) v1(61.8,82.45) v1(61.95,68.78) v1(61.95,67.77) v1(62.76,83.46) v1(62.76,82.45) v1(65.3,33.93) v1(65.3,32.92) v1(66.27,33.93) v1(66.27,32.92) v1(66.93,49.33) v1(66.93,48.31) v1(67.08,82.45) v1(67.08,81.43) v1(67.79,68.68) v1(67.79,67.67) v1(67.89,49.33) v1(67.89,48.31) v1(68.05,82.45) v1(68.05,81.43) v1(68.76,68.68) v1(68.76,67.67) v1(69.57,82.45) v1(69.57,81.43) v1(70.13,35.15) v1(70.54,82.45) v1(70.54,81.43) v1(71.09,35.15) v1(72.01,82.45) v1(72.01,81.43) v1(72.97,82.45) v1(72.97,81.43) v1(73.08,68.53) v1(73.08,67.51) v1(74.04,68.53) v1(74.04,67.51) v1(76.12,44.75) v1(76.12,43.74) v1(77.09,44.75) v1(77.09,43.74) v1(77.9,6.1) v1(77.9,5.08) v1(78.46,84.58) v1(78.46,83.57) v1(78.87,6.1) v1(78.87,5.08) v1(79.43,84.58) v1(79.43,83.57) v1(80.14,56.29) v1(80.14,55.27) v1(80.65,28.55) v1(80.65,25.7) v1(80.65,23.27) v1(80.65,22.25) v1(80.65,20.12) v1(80.65,18.03) v1(80.65,17.02) v1(80.65,15.04) v1(81.1,56.29) v1(81.1,55.27) v1(81.61,23.27) v1(81.61,22.25) v1(81.61,20.12) v1(81.61,18.03) v1(81.61,17.02) v1(81.61,15.04) v1(81.66,25.7) v1(81.97,28.55) v1(84.81,37.19) v1(84.81,36.17) v1(85.83,64.41) v1(85.83,63.4) v1(85.78,37.19) v1(85.78,36.17) v1(86.79,64.41) v1(86.79,63.4) v1(87.3,51.56) v1(87.3,50.55) v1(88.26,51.56) v1(88.26,50.55)
CONTROL_EXT: length 22.9
  Top Layer w0.305: U4.24 45.01,39.37 v1(45.01,40.89) ; R18.2 v1(45.01,56.44)
  Bottom Layer w0.305: v1(45.01,56.44) v1(45.01,40.89)
DQ: length 57.6
  Top Layer w0.305: U4.16 49.05,41.43 48.01,42.47 48.01,50.39 47.4,51 14.73,51 14.58,51.16 R20.1 4.57,53.47
EN_WI-FI: length 81.4
  Top Layer w0.305: v1(61.37,40.18) 61.37,60.55 61.87,61.06 75.49,61.06 75.95,61.52 75.95,74.68 76.05,74.78 86.06,74.78 86.61,75.34 86.61,77.24 86.55,77.3 86.55,79.77 86.41,79.91 85.69,79.91 C2.1 arc(85.72,80.14) 85.8,80.32 R2.2 ; U4.8 v1(61.37,35.58)
  Bottom Layer w0.305: v1(61.37,40.18) v1(61.37,35.58)
ESP32_TCK: length 16.7
  Top Layer w0.305: 71.08,72.75 69.29,72.75 68.78,73.25 H2.2
ESP32_TDI: length 11.2
  Top Layer w0.305: 72.58,77.3 72.46,77.42 71.63,77.42 71.32,77.72 H2.3
ESP32_TDO: length 28.2
  Top Layer w0.305: H2.1 66.24,64.31 66.7,63.86 71.08,63.86
ESP32_TMS: length 10.2
  Top Layer w0.305: H2.4 73.86,77.31 73.85,77.3
MCU_AIN1: length 85
  Top Layer w0.305: 72.61,19.23 R7.1 77.22,19.26 77.22,20.52 77.62,20.93 96.72,20.93 96.88,21.08 96.88,26.82 96.57,27.13 68.78,27.13 68.07,27.84 68.07,36.12 67.61,36.58 U4.10
MCU_AIN2: length 91.3
  Top Layer w0.305: C7.2 R8.1 77.16,14.14 77.16,15.49 77.42,15.75 97.03,15.75 97.33,16.05 97.33,27.28 97.03,27.58 69.34,27.58 68.58,28.35 68.58,36.26 67.76,37.08 U4.11
MCU_AIN3: length 32
  Top Layer w0.305: R10.1 72.61,29.76 ; C8.2 72.54,29.83 72.54,36.47 71.44,37.58 U4.12
MCU_AIN4: length 39.8
  Top Layer w0.305: U4.13 50.55,31.95 51.26,31.24 67.11,31.24 67.62,30.73 67.62,27.58 68.53,26.67 72.29,26.67 72.59,26.36 72.59,24.7 C9.2 R12.1
MCU_PWR_EN: length 13.9
  Top Layer w0.254: PWR.2 PWR.1 21.04,61.21 arc(21.05,61.21) U3.3
RTC_IO: length 24.1
  Top Layer w0.305: U6.6 26.47,29.06 26.72,28.8 28.25,28.8 28.4,28.96 28.4,34.65 28.8,35.05 43.27,35.05 U4.30
RTC_RST: length 20.6
  Top Layer w0.305: U4.29 43.28,35.56 28.19,35.56 27.74,35.1 U6.5
RTC_SCLK: length 32.2
  Top Layer w0.305: U6.7 25.2,37.59 25.7,38.1 44.7,38.1 45.26,37.54 47.75,37.54 48.06,37.85 48.06,39.32 U4.18
USR: length 49.5
  Top Layer w0.305: U4.33 39.47,33.58 38.96,33.07 38.96,27.89 38,26.92 15.39,26.92 15.24,26.77 R15.1 15.2,22.46 11.67,22.46 ; 11.67,22.46 USR.4 USR.3 ; 11.67,22.46 11.67,25.68
WI-FI_RXD: length 37.6
  Top Layer w0.305: R4.2 74.93,49.8 74.93,39.98 74.57,39.62 v1(62.33,39.62) ; v1(62.28,34.75) 62.11,34.58 U4.6
  Bottom Layer w0.305: v1(62.33,39.62) 62.28,39.57 v1(62.28,34.75)
WI-FI_TXD: length 41.1
  Top Layer w0.305: R3.2 77.93,39.22 77.52,38.81 v1(63.4,38.81) ; U4.5 v1(63.4,34.08)
  Bottom Layer w0.305: v1(63.4,34.08) v1(63.4,38.81)
$1N157: length 7.6
  Top Layer w0.305: 75.12,59.3 74.96,59.15 R4.1
$1N158: length 8.9
  Top Layer w0.305: R3.1 76.71,51.77 76.39,52.08 76.39,59.3
$1N183: length 22.8
  Top Layer w0.305: H1.2 97.79,49.78 84.89,49.78 84.01,50.66 84.01,59.3
$1N184: length 19.3
  Top Layer w0.305: 85.28,59.3 85.28,52.74 85.65,52.37 97.79,52.37 H1.1
$1N223: length 7.8
  Top Layer w0.305: R5.1 72.58,52.35 72.58,59.3
$1N393: length 15.3
  Top Layer w0.305: R7.2 94.43,19.23 arc(94.44,19.22) CN2.1
$1N403: length 15.3
  Top Layer w0.305: R8.2 94.43,14.12 arc(94.44,14.12) CN2.2
$1N404: length 15.3
  Top Layer w0.305: R10.2 94.43,29.76 arc(94.44,29.76) CN3.1
$1N405: length 15.3
  Top Layer w0.305: CN3.2 79.13,24.68 arc(79.12,24.68) R12.2
$1N538: length 34.1
  Top Layer w0.305: 16.05,42.67 R16.1 46.23,42.67 47.55,41.35 U4.19
$1N539: length 18.3
  Top Layer w0.305: H3.1 2.69,40.13 2.54,40.28 2.54,43.38 2.95,43.79 8.33,43.79 8.64,43.49 8.64,42.67 R16.2
$1N549: length 34.5
  Top Layer w0.305: R17.1 16.61,40.03 18.34,40.03 18.59,40.28 18.59,41.81 18.85,42.06 46.13,42.06 47.05,41.14 U4.20
$1N550: length 12.3
  Top Layer w0.305: R17.2 14.53,40.18 6.96,40.18 6.76,40.39 6.76,42.32 6.41,42.67 H3.2
$1N579: length 2.8
  Top Layer w0.305: LED1.1 R9.2
$1N580: length 26.8
  Top Layer w0.305: U4.43 48.05,15.59 47.24,14.78 38,14.78 37.64,14.43 LED1.2
$1N581: length 2.8
  Top Layer w0.305: LED2.1 45.37,10.71 R11.2
$1N601: length 2.8
  Top Layer w0.305: R13.2 52.62,7.97 LED3.1
$1N621: length 2.8
  Top Layer w0.305: LED4.1 60.2,10.74 R14.2
$1N641: length 20.4
  Top Layer w0.305: LED3.2 52.61,13.31 49.43,13.31 49.05,13.69 U4.45
$1N642: length 27.1
  Top Layer w0.305: U4.46 49.55,15.53 50.24,14.83 59.89,14.83 60.2,14.53 60.2,13.32 LED4.2
$1N643: length 19.9
  Top Layer w0.305: LED2.2 47.94,13.3 48.55,13.91 U4.44
$1N748: length 10.4
  Top Layer w0.305: R19.2 R18.1 54.87,62.18 Q1.2
$1N768: length 7.9
  Top Layer w0.305: Q1.3 57.15,63.1 BUZ1.2
$1N806: length 4.1
  Top Layer w0.254: U6.2 25.56,24.82 25.65,24.73 25.65,23.08 24.84,22.26 24.84,21.44
$1N807: length 4.1
  Top Layer w0.254: U6.3 26.15,24.82 26.06,24.73 26.06,23.08 26.87,22.26 X1.1

## Copper pours and planes (outline as drawn; the poured copper is in the pictures)
3.3V_MCU on Top Layer: 36.73,6.98 61.12,6.98 61.12,4.83 36.73,4.83
3.3V_MCU on Top Layer: 22.99,64.77 32.16,64.77 32.16,61.52 22.99,61.52
3.3V_WIFI on Top Layer: 36.57,80.21 53.85,80.21 53.85,76.66 36.57,76.66
+5V0 on Top Layer: 15.82,81.38 39.27,81.38 39.27,62.18 15.82,62.18
GND on Top Layer: -30.3,101.73 149.73,101.73 149.73,-50.22 -30.3,-50.22
GND on Bottom Layer: -6.48,95.38 117.93,95.38 117.93,-22.12 -6.48,-22.12
$1N495 on Top Layer: 12.78,82.24 18.98,82.24 18.98,77.27 12.78,77.27

Small or netless copper shapes (teardrops, artwork), in the pictures only: 184 on Top Layer, 8 on Bottom Layer

## Text on the board
Top Silkscreen Layer: 3.3V_MCU | 1N550 | 1N539 | GND | DQ | 1N184 | 1N183 | 1N404 | 1N405 | 1N403 | 1N393
